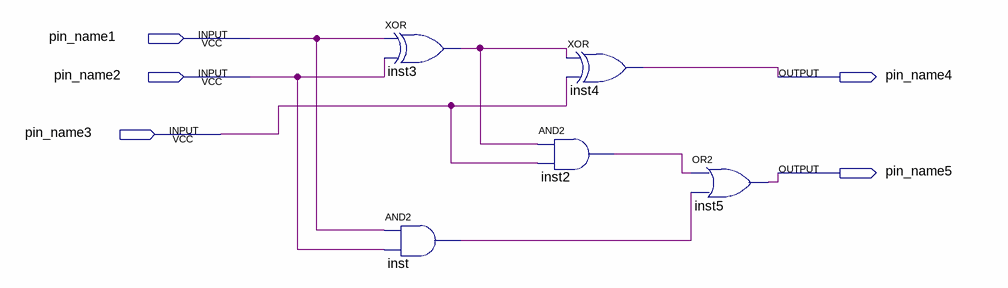
[diagram p0: schematic sheet]
// Quartus schematic week1.bdf as structural Verilog: 5 symbols, 5 pins
module week1 (
  input  pin_name1,
  input  pin_name2,
  input  pin_name3,
  output pin_name4,
  output pin_name5
);

  wire inst2_out, inst3_out, inst_out;

  xor inst3 (inst3_out, pin_name1, pin_name2);
  and inst (inst_out, pin_name1, pin_name2);
  and inst2 (inst2_out, inst3_out, pin_name3);
  xor inst4 (pin_name4, inst3_out, pin_name3);
  or inst5 (pin_name5, inst2_out, inst_out);
endmodule
